# EAGLE design BATT_PINZA_DCDC_top (EAGLE 9.6.2)
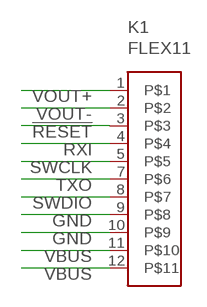
[diagram p0: schematic, sheet 1]

## Parts
K1  FLEX11  [FLEX11]

## Nets
!RESET: K1.3
GND: K1.9 K1.10
RXI: K1.4
SWCLK: K1.5
SWDIO: K1.8
TXO: K1.7
VBUS: K1.11 K1.12
VOUT+: K1.1
VOUT-: K1.2

## Library data of the parts
K1 = Flex_3mm:FLEX11

## Board
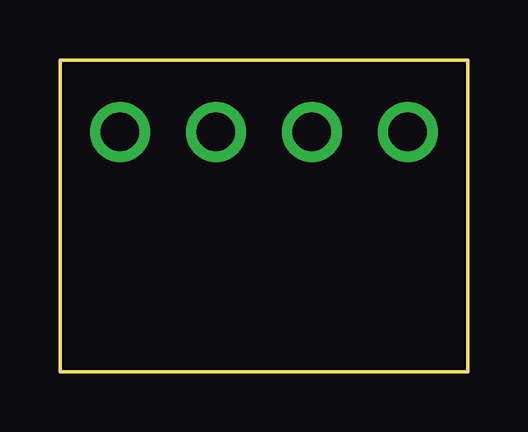
[diagram p1: board, top side]
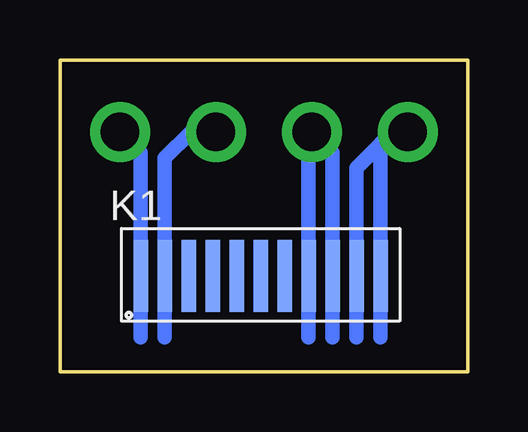
[diagram p2: board, bottom side, seen from below]

Size 17 x 13 mm. Coordinates in mm from the lower left corner, seen from the top.
Outline: 0,0 17,0 17,13 0,13 0,0
Copper layers (1*16): Top 0.035mm / dielectric 1.5mm / Bottom 0.035mm
Design rules "default": minimum track width 6mil, minimum drill 0.35mm, track to track 6mil, track to pad 6mil, pad to pad 6mil, via to via 6mil, smd to smd 6mil, copper to edge 40mil, drill to drill 6mil, minimum pad ring 10mil, minimum via ring 8mil, stop-mask expansion 4mil, vias tented up to drill 0mil, thermal gap 10mil

### Footprints (pad centres in the part's own frame; a part is rotated, then mirrored left to right if it is on the bottom)
FLEX11 = smd 0.6 x 3: 1 0.8,2.05; 2 1.8,2.05; 3 2.8,2.05; 4 3.8,2.05; 5 4.8,2.05; 7 5.8,2.05; 8 6.8,2.05; 9 7.8,2.05; 10 8.8,2.05; 11 9.8,2.05; 12 10.8,2.05

### Placement (x,y rotation side)
K1  14.43,1.95 0 bottom

### Tracks (layer width: path | path; a pad name or v marks a point on that pad's centre or on a via)
GND  (via drill 1.6 pad 2.5)
  Bottom 0.61: 5.63,1.43 K1.10 5.63,9.13 v6.5,10 6.63,9.87 K1.9 6.63,1.43
VBUS  (via drill 1.6 pad 2.5)
  Bottom 0.61: 3.63,1.43 K1.12 3.63,9.52 3.15,10 v2.5,10 3.13,10 4.63,8.5 K1.11 4.63,1.43
VOUT+  (via drill 1.6 pad 2.5)
  Bottom 0.61: v14.5,10 13.63,9.13 K1.1 13.63,1.43
VOUT-  (via drill 1.6 pad 2.5)
  Bottom 0.61: v10.5,10 11.54,10 12.63,8.91 K1.2 12.63,1.43